# EAGLE design piezo-preamp-tickler_V3-1_dual-supply-TL072 (EAGLE 8.4.3)
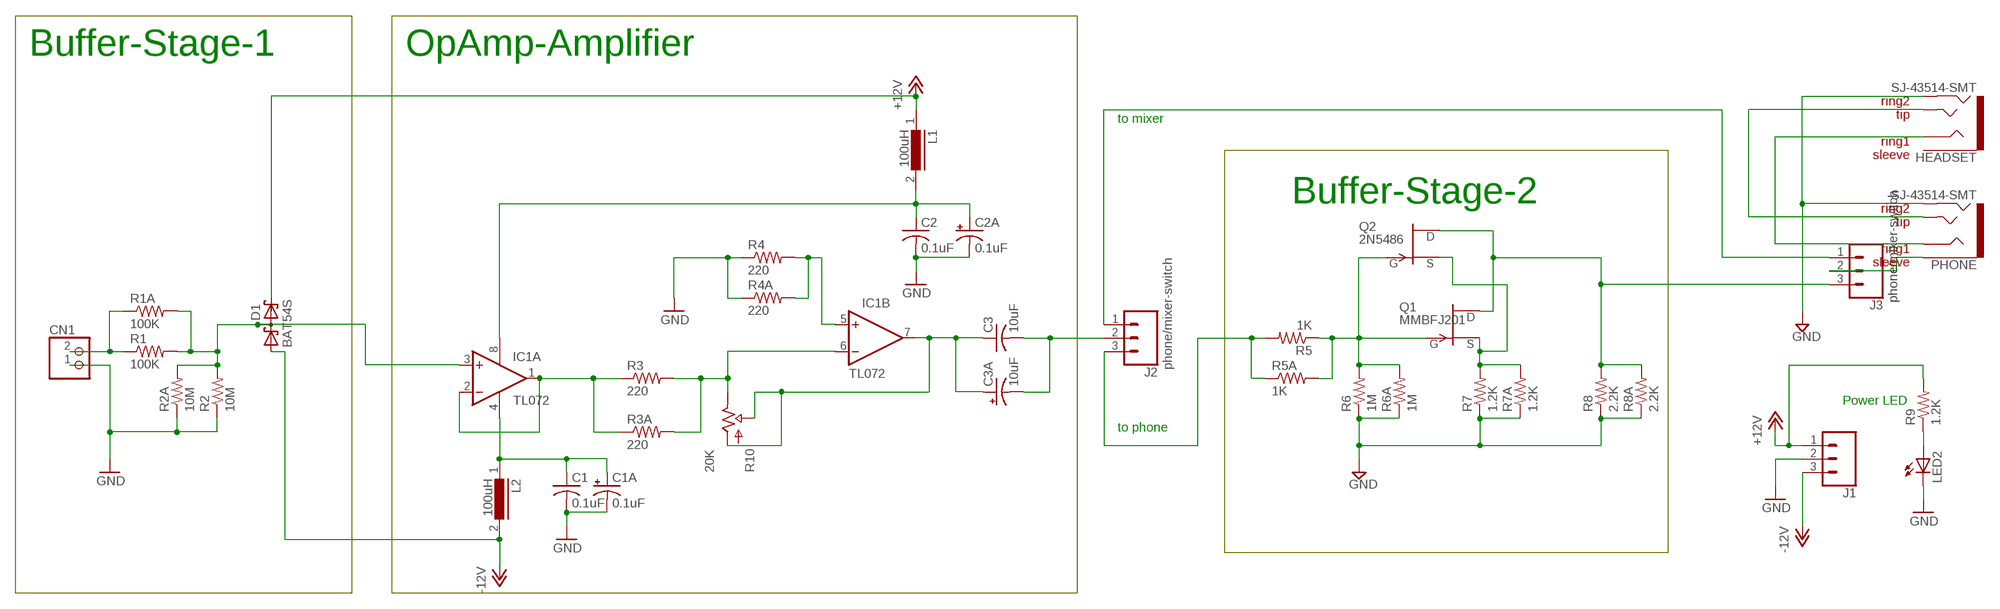
[diagram p0: schematic, sheet 1]

## Parts
C1  0.1uF  C-USC0805K  [C0805K]
C1A  0.1uF  CPOL-USE2,5-6E  [E2,5-6E]
C2  0.1uF  C-USC0805K  [C0805K]
C2A  0.1uF  CPOL-USE2,5-6E  [E2,5-6E]
C3  10uF  C-USC1206  [C1206]
C3A  10uF  CPOL-USE2,5-6E  [E2,5-6E]
CN1  JST_2PIN-THM  [JST-PH-2-THM]
D1  BAT54S  [SOT23]
HEADSET  SJ-43514-SMT  TRRS-3.5MMLGPADS  [TRRS_SJ-43514-SMT-TR]
IC1  TL072  OPA2134UA  [SO08]
J1  CONN_03LOCK  [1X03_LOCK]
J2  phone/mixer-switch  CONN_03LOCK  [1X03_LOCK]
J3  phone/mixer-switch  CONN_03LOCK  [1X03_LOCK]
L1  100uH  LBC-SE  [LBC-SE]
L2  100uH  LBC-SE  [LBC-SE]
LED2  LED3MM  [LED3MM]
PHONE  SJ-43514-SMT  TRRS-3.5MMLGPADS  [TRRS_SJ-43514-SMT-TR]
Q1  MMBFJ201  SST5484  [SOT23]
Q2  2N5486  [TO92-]
R1  100K  R-US_R0603  [R0603]
R1A  100K  R-US_0204/2V  [0204V]
R2  10M  R-US_R0603  [R0603]
R2A  10M  R-US_0204/2V  [0204V]
R3  220  R-US_R0603  [R0603]
R3A  220  R-US_0204/2V  [0204V]
R4  220  R-US_R0603  [R0603]
R4A  220  R-US_0204/2V  [0204V]
R5  1K  R-US_R0603  [R0603]
R5A  1K  R-US_0204/2V  [0204V]
R6  1M  R-US_R0603  [R0603]
R6A  1M  R-US_0204/2V  [0204V]
R7  1.2K  R-US_R0603  [R0603]
R7A  1.2K  R-US_0204/2V  [0204V]
R8  2.2K  R-US_R0603  [R0603]
R8A  2.2K  R-US_0204/2V  [0204V]
R9  1.2K  R-US_0204/2V  [0204V]
R10  20K  POTTRIMPOT-MULTI  [TRIMPOT-MULTI]

## Nets
+12V: D1.2(C2) J1.1 L1.1 R9.2
-12V: D1.1(A1) J1.3 L2.2
GND: C1.2 C1A.- C2.2 C2A.- CN1.1 HEADSET.RING2 J1.2 LED2.K(C) PHONE.RING2 R2.1 R2A.1 R4.1 R4A.1 R6.1 R6A.1 R7.1 R7A.1 R8.1 R8A.1
N$1: IC1.1(A:OUT) IC1.2(A:-IN) R3.1 R3A.1
N$3: J2.3 R5.2 R5A.1
N$4: C1.1 C1A.+ IC1.4(A:V-) L2.1
N$5: LED2.A R9.1
N$16: IC1.5(B:+IN) R4.2 R4A.2
N$22: IC1.6(B:-IN) R3.2 R3A.2 R10.P$1(OUT) R10.P$3(OUT) R10.P$4(OUT) R10.P$6(OUT) R10.P$9(OUT)
N$23: C3.2 C3A.- J2.2
N$24: CN1.2 R1.1 R1A.1
N$30: Q1.2(S) Q2.2(S) R7.2 R7A.2
N$31: C3.1 C3A.+ IC1.7(B:OUT) R10.P$10(WIPER) R10.P$12(WIPER) R10.P$13(WIPER) R10.P$15(WIPER) R10.P$16(WIPER) R10.P$18(WIPER) R10.P$20(IN) R10.P$21(IN) R10.P$22(IN) R10.P$24(IN) R10.P$27(IN)
N$32: C2.1 C2A.+ IC1.8(A:V+) L1.2
N$36: D1.3(C1A2) IC1.3(A:+IN) R1.2 R1A.2 R2.2 R2A.2
N$39: Q1.3(G) Q2.1(G) R5.1 R5A.2 R6.2 R6A.2
N$42: J2.1 J3.1
N$44: HEADSET.TIP PHONE.TIP
N$45: HEADSET.RING1 PHONE.RING1
N$46: J3.2 PHONE.EARTH
SELECT1: J3.3 Q1.1(D) Q2.3(D) R8.2 R8A.2
Unconnected: HEADSET.EARTH

## Notes on the sheet
- Buffer-Stage-1 | OpAmp-Amplifier
- to mixer
- Buffer-Stage-2
- Power LED
- to phone

## Library data of the parts
C1-C3 = adafruit:C-US: CAPACITOR, American symbol
C1A C2A C3A = rcl:CPOL-US: POLARIZED CAPACITOR, American symbol
CN1 = adafruit:JST_2PIN: JST 2-Pin Connectors of various flavors SMT-RA (S2B-PH-SM4) 4UConnector #17311 SMT (B2B-PH-SM4) THM-RA (S2B-PH) THM (B2B-PH)
D1 = diode:BAT54S: Schottky Diodes Pin connection corrected 2011-05-04 Source: Fairchild .. BAT54.pdf
HEADSET PHONE = CMU-ArtFab:TRRS-3.5MM: Audio jack - 3.5mm TRRS variety - two rings.
IC1 = linear:OPA2*: Dual Operational Amplifier Low Power, Single-Supply, Rail-To-Rail Operational Amplifier Source: http://focus.ti.com/lit/ds/symlink/opa2345.pdf http://focus.ti.com .. opa241.pdf http://focus.ti.com/lit/ds/symlink/opa2134.pdf
J1-J3 = SparkFun-Connectors:CONN_03: Multi connection point. Often used as Generic Header-pin footprint for 0.1 inch spaced/style header connections On any of the 0.1 inch spaced packages, you can populate with these: Break Away Headers - Straight <https://www.sparkfun.com/products/116> (PRT-00116) Break Away Male Headers - Right Angle <https://www.sparkfun.com/products/553> (PRT-00553) Female Headers <https://www.sparkfun.com/products/115> (PRT-00115) Break Away Headers - Machine Pin <https://www.sparkfun.com/products/117> (PRT-00117) Break Away Female Headers - Swiss Machine Pin <https://www.sparkfun.com/products/743> (PRT-00743) Stackable Header - 3 Pin (Female, 0.1") <https://www.sparkfun.com/products/13875> (PRT-13875) For SCREWTERMINALS and SPRING TERMINALS visit here: Screw Terimnals on SparkFun.com <https://www.sparkfun.com/search/results?term=Screw+Terminals> (5mm/3.5mm/2.54mm spacing) This device is also useful as a general connection point to wire up your design to another part of your project. Our various solder wires solder well into these plated through hole pads. Hook-Up Wire - Assortment (Stranded, 22 AWG) <https://www.sparkfun.com/products/11375> (PRT-11375) Hook-Up Wire - Assortment (Solid Core, 22 AWG) <https://www.sparkfun.com/products/11367> (PRT-11367) View the entire wire category on our website here <https://www.sparkfun.com/categories/141> Special notes: Molex polarized connector foot print use with SKU : PRT-08232 with associated crimp pins and housings.
L1 L2 = inductors:LBC-SE: INDUCTOR
LED2 = led:LED: LED OSRAM: - CHIPLED LG R971, LG N971, LY N971, LG Q971, LY Q971, LO R971, LY R971 LH N974, LH R974 LS Q976, LO Q976, LY Q976 LO Q996 - Hyper CHIPLED LW Q18S LB Q993, LB Q99A, LB R99A - SideLED LS A670, LO A670, LY A670, LG A670, LP A670 LB A673, LV A673, LT A673, LW A673 LH A674 LY A675 LS A676, LA A676, LO A676, LY A676, LW A676 LS A679, LY A679, LG A679 - Hyper Micro SIDELED® LS Y876, LA Y876, LO Y876, LY Y876 LT Y87S - SmartLED LW L88C, LW L88S LB L89C, LB L89S, LG L890 LS L89K, LO L89K, LY L89K LS L896, LA L896, LO L896, LY L896 - TOPLED LS T670, LO T670, LY T670, LG T670, LP T670 LSG T670, LSP T670, LSY T670, LOP T670, LYG T670 LG T671, LOG T671, LSG T671 LB T673, LV T673, LT T673, LW T673 LH T674 LS T676, LA T676, LO T676, LY T676, LB T676, LH T676, LSB T676, LW T676 LB T67C, LV T67C, LT T67C, LS T67K, LO T67K, LY T67K, LW E67C LS E67B, LA E67B, LO E67B, LY E67B, LB E67C, LV E67C, LT E67C LW T67C LS T679, LY T679, LG T679 LS T770, LO T770, LY T770, LG T770, LP T770 LB T773, LV T773, LT T773, LW T773 LH T774 LS E675, LA E675, LY E675, LS T675 LS T776, LA T776, LO T776, LY T776, LB T776 LHGB T686 LT T68C, LB T68C - Hyper Mini TOPLED® LB M676 - Mini TOPLED Santana® LG M470 LS M47K, LO M47K, LY M47K Source: http://www.osram.convergy.de LUXEON: - LUMILED® LXK2-PW12-R00, LXK2-PW12-S00, LXK2-PW14-U00, LXK2-PW14-V00 LXK2-PM12-R00, LXK2-PM12-S00, LXK2-PM14-U00 LXK2-PE12-Q00, LXK2-PE12-R00, LXK2-PE12-S00, LXK2-PE14-T00, LXK2-PE14-U00 LXK2-PB12-K00, LXK2-PB12-L00, LXK2-PB12-M00, LXK2-PB14-N00, LXK2-PB14-P00, LXK2-PB14-Q00 LXK2-PR12-L00, LXK2-PR12-M00, LXK2-PR14-Q00, LXK2-PR14-R00 LXK2-PD12-Q00, LXK2-PD12-R00, LXK2-PD12-S00 LXK2-PH12-R00, LXK2-PH12-S00 LXK2-PL12-P00, LXK2-PL12-Q00, LXK2-PL12-R00 Source: www.luxeon.com KINGBRIGHT: KA-3528ASYC Source: www.kingbright.com
Q1 = transistor-fet:?548*: N-Channel JFETs Source: VISHAY 2N5484.pdf Compatible: TO92 2N5245 J304 J305 U310 J308 J309 J310 TO72 2N4416 2N4416A 2N3823 2N4351 3N169 3N170 3N171 MFE3002 TO18 2N3796 2N3797 MFE825 Source: Motorola European Master Guide Pacge 3-59
Q2 = CMU-ArtFab:?548*: N-Channel JFETs Source: VISHAY 2N5484.pdf Compatible: TO92 2N5245 J304 J305 U310 J308 J309 J310 TO72 2N4416 2N4416A 2N3823 2N4351 3N169 3N170 3N171 MFE3002 TO18 2N3796 2N3797 MFE825 Source: Motorola European Master Guide Pacge 3-59
R1 R1A R2 R2A R3 R3A R4 R4A R5 R5A R6 R6A R7 R7A R8 R8A R9 = CMU-ArtFab:R-US_: RESISTOR, American symbol
R10 = CMU-ArtFab:POT: http://www.taydaelectronics.com/10k-ohm-linear-taper-potentiometer-round-shaft-pcb-9mm.html http://www.taydaelectronics.com/datasheets/A-1847.pdf

## Net classes
0 default: width 0.152 mm, clearance 0.2 mm

## Board
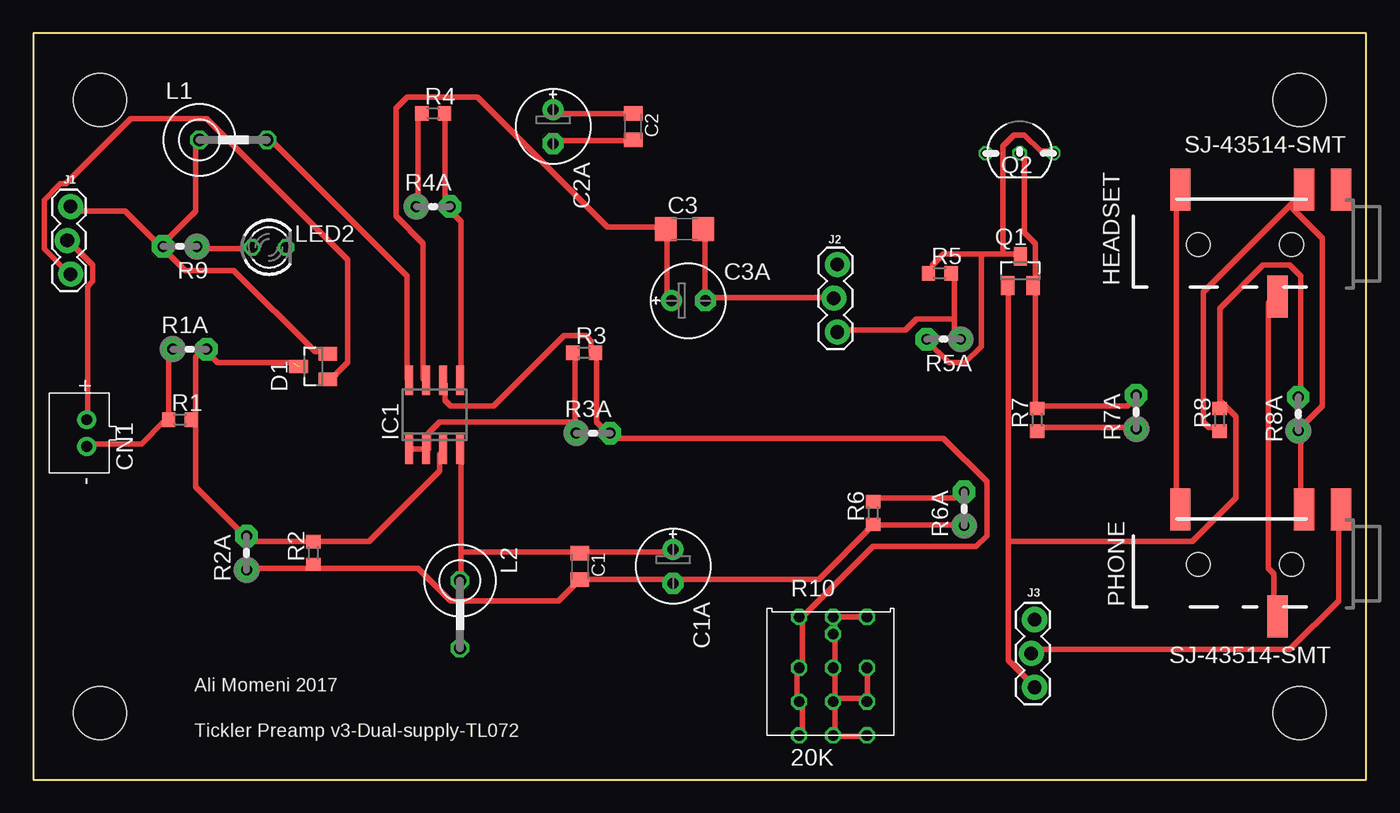
[diagram p1: board, top side]
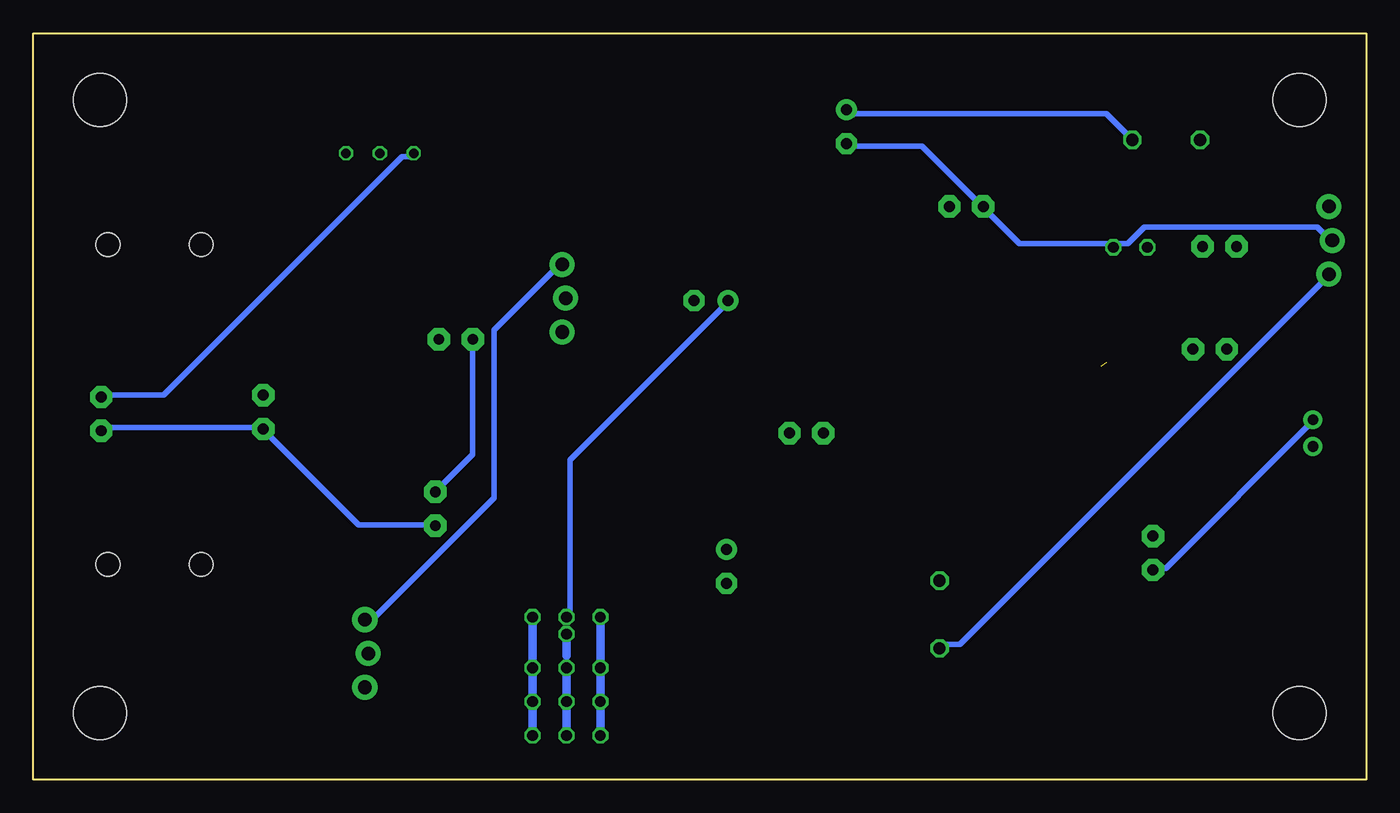
[diagram p2: board, bottom side, seen from below]

Size 100 x 56 mm. Coordinates in mm from the lower left corner, seen from the top.
Outline: 0,0 100,0 100,56 0,56 0,0
Copper layers (1*16): Top 0.0356mm / dielectric 1.5011mm / Bottom 0.0356mm
Design rules "oshpark-2layer *": minimum track width 16mil, minimum drill 13mil, track to track 16mil, track to pad 16mil, pad to pad 16mil, via to via 16mil, smd to smd 16mil, copper to edge 15mil, drill to drill 6mil, minimum pad ring 7mil, minimum via ring 7mil, stop-mask expansion 2.5mil, vias tented up to drill 0mil, thermal gap 10mil
Holes 4 mm at 5,51 5,5 95,51 95,5

### Footprints (pad centres in the part's own frame; a part is rotated, then mirrored left to right if it is on the bottom)
C0805K = smd 1.1 x 1.4: 1 -1,0; 2 1,0
E2,5-6E = drill 0.813 pad 1.575: + -1.27,0 | drill 0.813 pad 1.575 octagon: - 1.27,0
C1206 = smd 1.6 x 1.8: 1 -1.4,0; 2 1.4,0
JST-PH-2-THM = drill 0.8 pad 1.422: 1 1,0; 2 -1,0
SOT23 = smd 1 x 1.4: 1 -0.95,-1.1; 2 0.95,-1.1; 3 0,1.1
TRRS_SJ-43514-SMT-TR = smd 1.524 x 3.175: EARTH -2.114,-5.271; RING1 2.644,2.759; RING2 0.66,-5.271; TIP 9.948,-5.271 | hole 1.778: 1.6,-1.15; 8.6,-1.15
SO08 = smd 0.6 x 2.2: 1 -1.905,-2.6; 2 -0.635,-2.6; 3 0.635,-2.6; 4 1.905,-2.6; 5 1.905,2.6; 6 0.635,2.6; 7 -0.635,2.6; 8 -1.905,2.6
1X03_LOCK = drill 1.016 pad 1.88: 1 0,0.127; 2 2.54,-0.127; 3 5.08,0.127
LBC-SE = drill 0.914 octagon: 1 -2.54,0; 2 2.54,0
LED3MM = drill 0.813 octagon: A -1.27,0; K 1.27,0
TO92- = drill 0.7 octagon: 1 2.54,0; 2 0,0; 3 -2.54,0
R0603 = smd 1 x 1.1: 1 -0.85,0; 2 0.85,0
0204V = drill 0.813 pad 1.676 octagon: 1 -1.27,0; 2 1.27,0
TRIMPOT-MULTI = drill 0.8 octagon: P$1 -2.54,-4.699; P$3 -2.54,-2.159; P$4 -2.54,-2.159; P$6 -2.54,0.381; P$9 -2.54,4.191; P$10 0,-4.699; P$12 0,-2.159; P$13 0,-2.159; P$15 0,0.381; P$16 0,2.921; P$18 0,4.191; P$20 2.54,-4.699; P$21 2.54,-2.159; P$22 2.54,-2.159; P$24 2.54,0.381; P$27 2.54,4.191

### Placement (x,y rotation side)
C1  41,16 270 top
C1A  48,16 270 top
C2  45,49 270 top
C2A  39,49 270 top
C3  48.86,41.3 0 top
C3A  49.15,35.94 0 top
CN1  4,26 90 top
D1  21,31 90 top
HEADSET  96,39 180 top
IC1  30.09,27.37 0 top
J1  2.67,43 270 top
J2  60.19,38.66 270 top
J3  75,12 270 top
L1  15,48 0 top
L2  32.01,12.39 270 top
LED2  17.69,39.94 0 top
PHONE  96,15 180 top
Q1  74.05,38.17 0 top
Q2  74,47 0 top
R1  11,27 0 top
R1A  11.73,32.3 0 top
R2  21,17 90 top
R2A  16,17 90 top
R3  41.33,32.03 0 top
R3A  42,26 0 top
R4  30,50 0 top
R4A  30,43 0 top
R5  68,38 0 top
R5A  68.3,33.04 180 top
R6  63,20 90 top
R6A  69.84,20.32 90 top
R7  75.31,27 90 top
R7A  82.75,27.58 90 top
R8  89,27 90 top
R8A  94.91,27.44 90 top
R9  11,40 180 top
R10  60,8 0 top

### Tracks (layer width: path | path; a pad name or v marks a point on that pad's centre or on a via)
+12V
  Top 0.406: D1.2 21.95,32.11 21.13,32.11 15.04,38.2 11.38,38.2 9.75,39.83 R9.2 | L1.1 12.19,47.95 12.19,42.67 9.75,40.23 R9.2 | J1.1 2.85,42.67 6.91,42.67 9.35,40.23 R9.2
-12V
  Top 0.406: D1.1 22.35,30.07 23.57,31.29 23.57,39.01 13.01,49.58 7.32,49.58 2.44,44.7 2.03,44.7 0.81,43.48 0.81,39.83 2.44,38.2 J1.3
  Bottom 0.406: L2.2 31.7,10.16 30.48,10.16 2.85,37.8 J1.3
GND
  Top 0.406: C2.2 44.7,47.95 39.01,47.95 C2A.- | R4.1 28.85,49.99 28.85,43.08 R4A.1 | R2A.1 16.26,15.85 20.73,15.85 R2.1 21.13,15.85 28.85,15.85 31.29,13.41 39.42,13.41 40.64,14.63 C1.2 41.05,15.04 47.95,15.04 C1A.- 48.36,15.04 58.93,15.04 62.99,19.1 R6.1 63.4,19.1 69.49,19.1 R6A.1 | CN1.1 4.06,27.23 4.06,36.98 4.47,37.39 4.47,38.61 2.85,40.23 J1.2 | 94.28,43.08 95.1,43.89 HEADSET.RING2 | 94.28,43.08 87.78,36.58 87.78,26.82 88.19,26.42 88.59,26.42 R8.1 | R7.1 75.59,26.42 82.5,26.42 R7A.1 | PHONE.RING2 95.1,20.32 95.1,26.01 R8A.1 95.1,26.42 96.72,28.04 96.72,40.64 94.28,43.08
  Bottom 0.406: C2A.- 38.61,47.55 33.33,47.55 28.85,43.08 R4A.1 28.45,42.67 26.01,40.23 19.1,40.23 LED2.K 18.69,40.23 17.88,40.23 16.66,41.45 3.66,41.45 2.85,40.64 J1.2 | R2A.1 15.85,15.85 15.04,15.85 4.06,26.82 CN1.1 | R8A.1 94.69,26.42 82.91,26.42 R7A.1 82.5,26.01 75.59,19.1 69.9,19.1 R6A.1
N$1
  Top 0.406: IC1.1 28.45,24.79 29.26,24.79 IC1.2 29.67,24.79 29.67,26.01 30.48,26.82 40.64,26.82 | 40.64,26.82 40.64,26.01 R3A.1 40.64,26.82 | 40.64,26.82 40.64,31.7 R3.1
N$3
  Top 0.406: 69.09,34.54 69.09,33.73 69.49,33.33 R5A.1 | 69.09,34.54 69.09,37.8 R5.2 | 69.09,34.54 66.24,34.54 65.43,33.73 60.55,33.73 J2.3
N$4
  Top 0.406: C1A.+ 47.95,17.07 41.05,17.07 C1.1 40.64,17.07 32.11,17.07 | 32.11,17.07 32.11,15.04 L2.1 | 32.11,17.07 32.11,24.38 IC1.4
N$5
  Top 0.406: LED2.A 16.26,39.83 12.6,39.83 R9.1
N$16
  Top 0.406: R4.2 30.89,49.99 30.89,43.08 R4A.2 31.29,42.67 32.11,41.86 32.11,30.07 IC1.5
N$22
  Top 0.406: R10.P$1 57.71,3.66 57.71,5.69 R10.P$3 57.3,6.1 57.3,8.13 R10.P$6 57.71,8.53 57.71,11.79 R10.P$9 57.71,12.19 62.99,17.48 70.71,17.48 71.53,18.29 71.53,22.35 68.28,25.6 43.48,25.6 R3A.2 43.08,26.01 42.27,26.82 42.27,31.7 R3.2 41.86,32.11 41.86,32.92 41.45,33.33 39.83,33.33 34.54,28.04 31.29,28.04 30.89,28.45 30.89,29.67 IC1.6
N$23
  Top 0.406: C3.2 50.39,41.05 50.39,36.17 C3A.- 50.8,36.17 59.74,36.17 J2.2
N$24
  Top 0.406: R1A.1 10.16,32.11 10.16,27.23 R1.1 9.75,26.82 8.13,25.2 4.06,25.2 CN1.2
N$30
  Top 0.406: R7A.2 82.5,28.45 82.09,28.04 75.59,28.04 R7.2 75.18,28.04 75.18,36.98 Q1.2 75.18,37.39 75.18,40.23 74.37,41.05 74.37,46.74 Q2.2
N$31
  Top 0.406: R10.P$27 62.18,12.19 60.15,12.19 R10.P$18 60.15,11.79 60.15,10.97 R10.P$16 60.15,10.57 60.15,8.53 R10.P$15 60.15,8.13 60.15,6.1 | R10.P$24 62.59,8.13 62.59,6.1 R10.P$21 62.18,6.1 60.15,6.1 | R10.P$20 62.18,3.25 60.15,3.25 R10.P$10 60.15,3.66 60.15,5.69 R10.P$13 60.15,6.1 | C3A.+ 47.55,36.17 47.55,41.05 C3.1 47.14,41.45 43.08,41.45 33.33,51.21 28.04,51.21 27.23,50.39 27.23,42.27 29.26,40.23 29.26,30.07 IC1.7
  Bottom 0.406: R10.P$18 59.74,12.19 59.74,23.98 47.95,35.76 C3A.+
N$32
  Top 0.406: C2.1 44.7,49.99 39.01,49.99 C2A.+ | IC1.8 28.04,30.07 28.04,37.8 17.88,47.95 L1.2
  Bottom 0.406: C2A.+ 38.61,49.99 19.51,49.99 17.88,48.36 L1.2
N$36  (1 unrouted)
  Top 0.406: 19.51,31.29 13.82,31.29 13.01,32.11 R1A.2 12.6,32.11 12.19,31.7 12.19,27.23 R1.2 12.19,26.82 12.19,21.95 15.85,18.29 R2A.2 16.26,17.88 20.73,17.88 R2.2 21.13,17.88 25.2,17.88 30.48,23.16 30.48,24.38 IC1.3
N$39
  Top 0.406: 72.75,39.42 73.97,39.42 Q1.3 | 72.75,39.42 71.12,39.42 | 71.12,39.42 68.28,39.42 67.46,38.61 67.46,38.2 R5.1 | 72.75,39.42 72.75,47.55 73.56,48.36 74.37,48.36 75.59,47.14 76.4,47.14 Q2.1 | R6.2 63.4,21.13 69.09,21.13 69.49,21.54 R6A.2 | 71.12,39.42 71.12,32.51 69.9,31.29 68.68,31.29 67.06,32.92 R5A.2
  Bottom 0.406: R5A.2 67.06,32.92 67.06,24.38 69.49,21.95 R6A.2
N$42
  Bottom 0.406: J2.1 60.55,38.61 65.43,33.73 65.43,21.13 74.78,11.79 J3.1
N$44
  Top 0.406: PHONE.TIP 85.75,20.32 85.75,43.89 HEADSET.TIP
N$45
  Top 0.406: PHONE.RING1 93.07,12.6 93.07,15.44 92.66,15.85 92.66,35.76 93.07,36.17 HEADSET.RING1
N$46
  Top 0.406: PHONE.EARTH 97.94,19.91 97.94,13.41 94.28,9.75 75.18,9.75 J3.2
SELECT1
  Top 0.406: 73.15,17.88 73.15,8.94 74.78,7.32 J3.3 | 73.15,17.88 73.15,36.98 Q1.1 | 89,28.45 89,35.36 92.25,38.61 94.28,38.61 95.1,37.8 95.1,28.85 R8A.2 | 89,28.45 89,28.04 R8.2 | 73.15,17.88 86.97,17.88 90.22,21.13 90.22,27.23 89,28.45
  Bottom 0.406: Q2.3 71.53,46.74 72.34,46.74 90.22,28.85 94.69,28.85 R8A.2

### Text on the board
tNames: Ali Momeni 2017 | Tickler Preamp v3-Dual-supply-TL072